# Altium schematic sheet BPC_PWR_Temp_Sensor.SchDoc
size A4; SheetNumber: 5; SheetTotal: 5
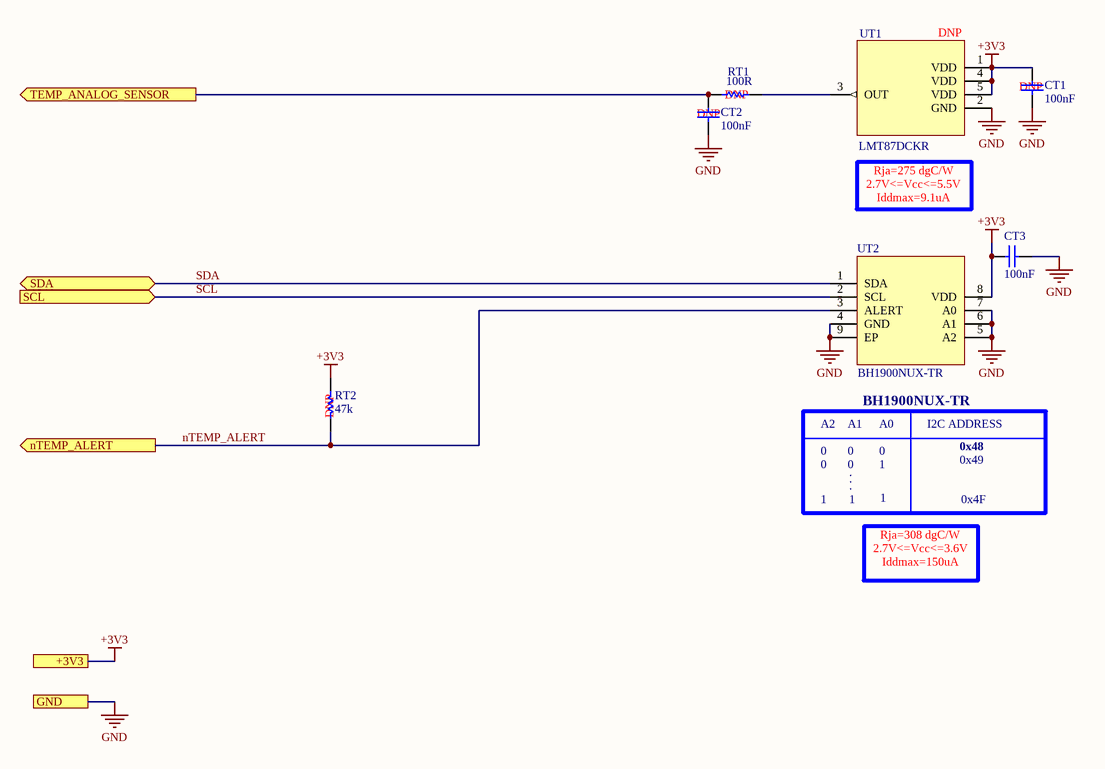
[diagram p0: BPC_PWR_Temp_Sensor.SchDoc]

## Parts
CT1  Populated: DNP  Capacitance: 100nF  [C0603L 0.8 MM MS]  (hidden comment: Ceramic Capacitor)
CT2  Populated: DNP  Capacitance: 100nF  [C0603L 0.8 MM MS]  (hidden comment: Ceramic Capacitor)
CT3  Capacitance: 100nF  [C0603L 0.8 MM MS]  (hidden comment: Ceramic Capacitor)
RT1  Populated: DNP  Resistance: 100R  [R0603L 0.45MM MS]  (hidden comment: Resistor)
RT2  Populated: DNP  Resistance: 47k  [R0603L 0.45MM MS]  (hidden comment: Resistor)
UT1  LMT87DCKR  Populated: DNP  [DCK5 MS]
UT2  BH1900NUX-TR  [SON50P300X200X60-9N-D ms]

## Ports
+3V3, GND, nTEMP_ALERT (out), SCL (in), SDA (bidir), TEMP_ANALOG_SENSOR (out)

## Nets
+3V3: CT1.2 CT3.2 RT2.2 UT1.1(VDD) UT1.4(VDD) UT1.5(VDD) UT2.8(VDD) ; port +3V3
GND: CT1.1 CT2.1 CT3.1 UT1.2(GND) UT2.4(GND) UT2.5(A2) UT2.6(A1) UT2.7(A0) UT2.9(EP) ; port GND
nTEMP_ALERT: RT2.1 UT2.3(ALERT) ; port nTEMP_ALERT
SCL: UT2.2(SCL) ; port SCL
SDA: UT2.1(SDA) ; port SDA
TEMP_ANALOG_SENSOR: CT2.2 RT1.1 ; port TEMP_ANALOG_SENSOR
NetRT1_2: RT1.2 UT1.3(OUT)

## Notes on the sheet
- Rja=275 dgC/W
  2.7V<=Vcc<=5.5V
  Iddmax=9.1uA
- A2
- 0
- A1
- BH1900NUX-TR
- A0
- I2C ADDRESS
- 0x48
- 1
- .
- 0x49
- 0x4F
- Rja=308 dgC/W
  2.7V<=Vcc<=3.6V
  Iddmax=150uA
- Project:
- Document:
- Engineer:
- Version:
- Sheet
- of
- Company:
- Date:

## Library data of the parts
CT1-CT3 = Cap Cer 100nF 50V X7R 0603 Pt02: Ceramic Capacitor 100nF 50V X7R 0603; Manufacturer: Samsung Electro-Mechanics; Manufacturer Part Number: CL10B104KB8WPNC; Tolerance: ±10%; Distributor: Mouser; Distributor Part Number: 187-CL10B104KB8WPNC; Last Revision Date: 19.10.2020.; Temperature Range: -55°C ~ +125°C; Mounting: SMD; ComponentLink1Description: Datasheet; ComponentLink1URL: https://eu.mouser.com/datasheet/2/396/mlcc02_e-1307760.pdf; ComponentLink2Description: Distributor; ComponentLink2URL: https://eu.mouser.com/ProductDetail/Taiyo-Yuden/JMK212BJ476MG-T?qs=I6KAKw0tg2zBfYZ1Prs1hQ%3D%3D; ComponentLink3Description: Manufacturer; ComponentLink3URL: https://ds.yuden.co.jp/TYCOMPAS/or/detail?pn=JMK212BBJ476MG-T&u=M; Status: Not Checked; Voltage: 50V; Dielectric: X7R; ComponentLink4Description: Charts; DB Parameter 1: 100nF; DB Parameter 2: 50V; DB Parameter 3: X7R
RT1 = Res 100R 1% 100mW 0603 MS Pt02: Resistor 100R 1% 100mW 0603; Manufacturer: Stackpole Electronics Inc; Manufacturer Part Number: RMCF0603FT100R; Temperature Coefficient: 100ppm/°C; Production Status: Active; Distributor: Digi-Key; Distributor Part Number: RMCF0603FT100RCT-ND; Last Revision Date: 26.07.2021; Temperature Range: -55°C ~ +155°C; Mounting: SMD; ComponentLink1Description: Datasheet; ComponentLink1URL: https://www.seielect.com/catalog/sei-rmcf_rmcp.pdf; ComponentLink2Description: Distributor; ComponentLink2URL: https://www.digikey.com/en/products/detail/stackpole-electronics-inc/RMCF0603FT100R/1761113; ComponentLink3Description: Manufacturer; ComponentLink3URL: https://www.seielect.com/catalog/sei-rmcf_rmcp.pdf; Status: Not Checked; Power Rating: 100mW; Tolerance: ±1%; DB Parameter 1: 100R; DB Parameter 2: ±1%; DB Parameter 3: 100mW
RT2 = Res 47k 1% 100mW 0603 MS: Resistor 47k 1% 100mW 0603; Manufacturer: Yageo; Manufacturer Part Number: RT0603FRE0747KL; Temperature Coefficient: ±50ppm/°C; Production Status: Active; Distributor: Digi-Key; Distributor Part Number: YAG3355CT-ND; Last Revision Date: 08.06.2021; Temperature Range: -55°C ~ +155°C; Mounting: SMD; ComponentLink1Description: Datasheet; ComponentLink1URL: https://www.yageo.com/upload/media/product/productsearch/datasheet/rchip/PYu-RT_1-to-0.01_RoHS_L_12.pdf; ComponentLink2Description: Distributor; ComponentLink2URL: https://www.digikey.com/en/products/detail/yageo/RT0603FRE0747KL/1075386; ComponentLink3Description: Manufacturer; ComponentLink3URL: https://www.yageo.com/en/ProductSearch/PartNumberSearch?part_number=RT0603FRE0747KL; Status: Not Checked; Power Rating: 100mW; Tolerance: ±1%; DB Parameter 1: 47k; DB Parameter 2: ±1%; DB Parameter 3: 100mW
UT1 = IC LMT87DCKR MS: SENSOR ANALOG -50C-150C SC70-5; Manufacturer: Texas Instruments; Power Supply: 2.7V ~ 5.5V; Production Status: Active; Distributor: Mouser; Distributor Part Number: 595-LMT87DCKR; Last Revision Date: 13.12.2021; Temperature Range: -50°C ~ +150°C; Mounting: SMD; ComponentLink1Description: Datasheet; ComponentLink1URL: https://www.ti.com/lit/ds/symlink/lmt87.pdf?ts=1639410757849&ref_url=https%253A%252F%252Fwww.ti.com%252Fstore%252Fti%252Fen%252Fp%252Fproduct%252F%253Fp%253DLMT87DCKR; ComponentLink2Description: Distributor; ComponentLink2URL: https://eu.mouser.com/ProductDetail/Texas-Instruments/LMT87DCKR?qs=TB%2FQ0sBK%2FGewwiyaPQc1Yw%3D%3D; ComponentLink3Description: Manufacturer; ComponentLink3URL: https://www.ti.com/store/ti/en/p/product/?p=LMT87DCKR; Status: Not Checked; DB Parameter 1: LMT87DCKR
UT2 = IC BH1900NUX-TR MS: SENSOR DGTL -20C-85C 8VSON; Manufacturer: ROHM Semiconductor; Power Supply: 2.7V ~ 3.6V; Production Status: Active; Distributor: Mouser; Distributor Part Number: 755-BH1900NUX-TR296-29100-1-ND; Last Revision Date: 13.12.2021; Temperature Range: -30°C ~ +95°C; Mounting: SMD; ComponentLink1Description: Datasheet; ComponentLink1URL: https://eu.mouser.com/datasheet/2/348/bh1900nux_e-1874465.pdf; ComponentLink2Description: Distributor; ComponentLink2URL: https://eu.mouser.com/ProductDetail/ROHM-Semiconductor/BH1900NUX-TR?qs=HXFqYaX1Q2wlYjOjhnBtEw%3D%3D; ComponentLink3Description: Manufacturer; ComponentLink3URL: https://www.rohm.com/site-search/-/rohmsearch/scope/site?searchKeyword=BH1900NUX-TR; Status: Not Checked; DB Parameter 1: BH1900NUX-TR